# EAGLE design v0.1.0 (EAGLE 9.2.2)

## Sheet 1 of 2: Interface
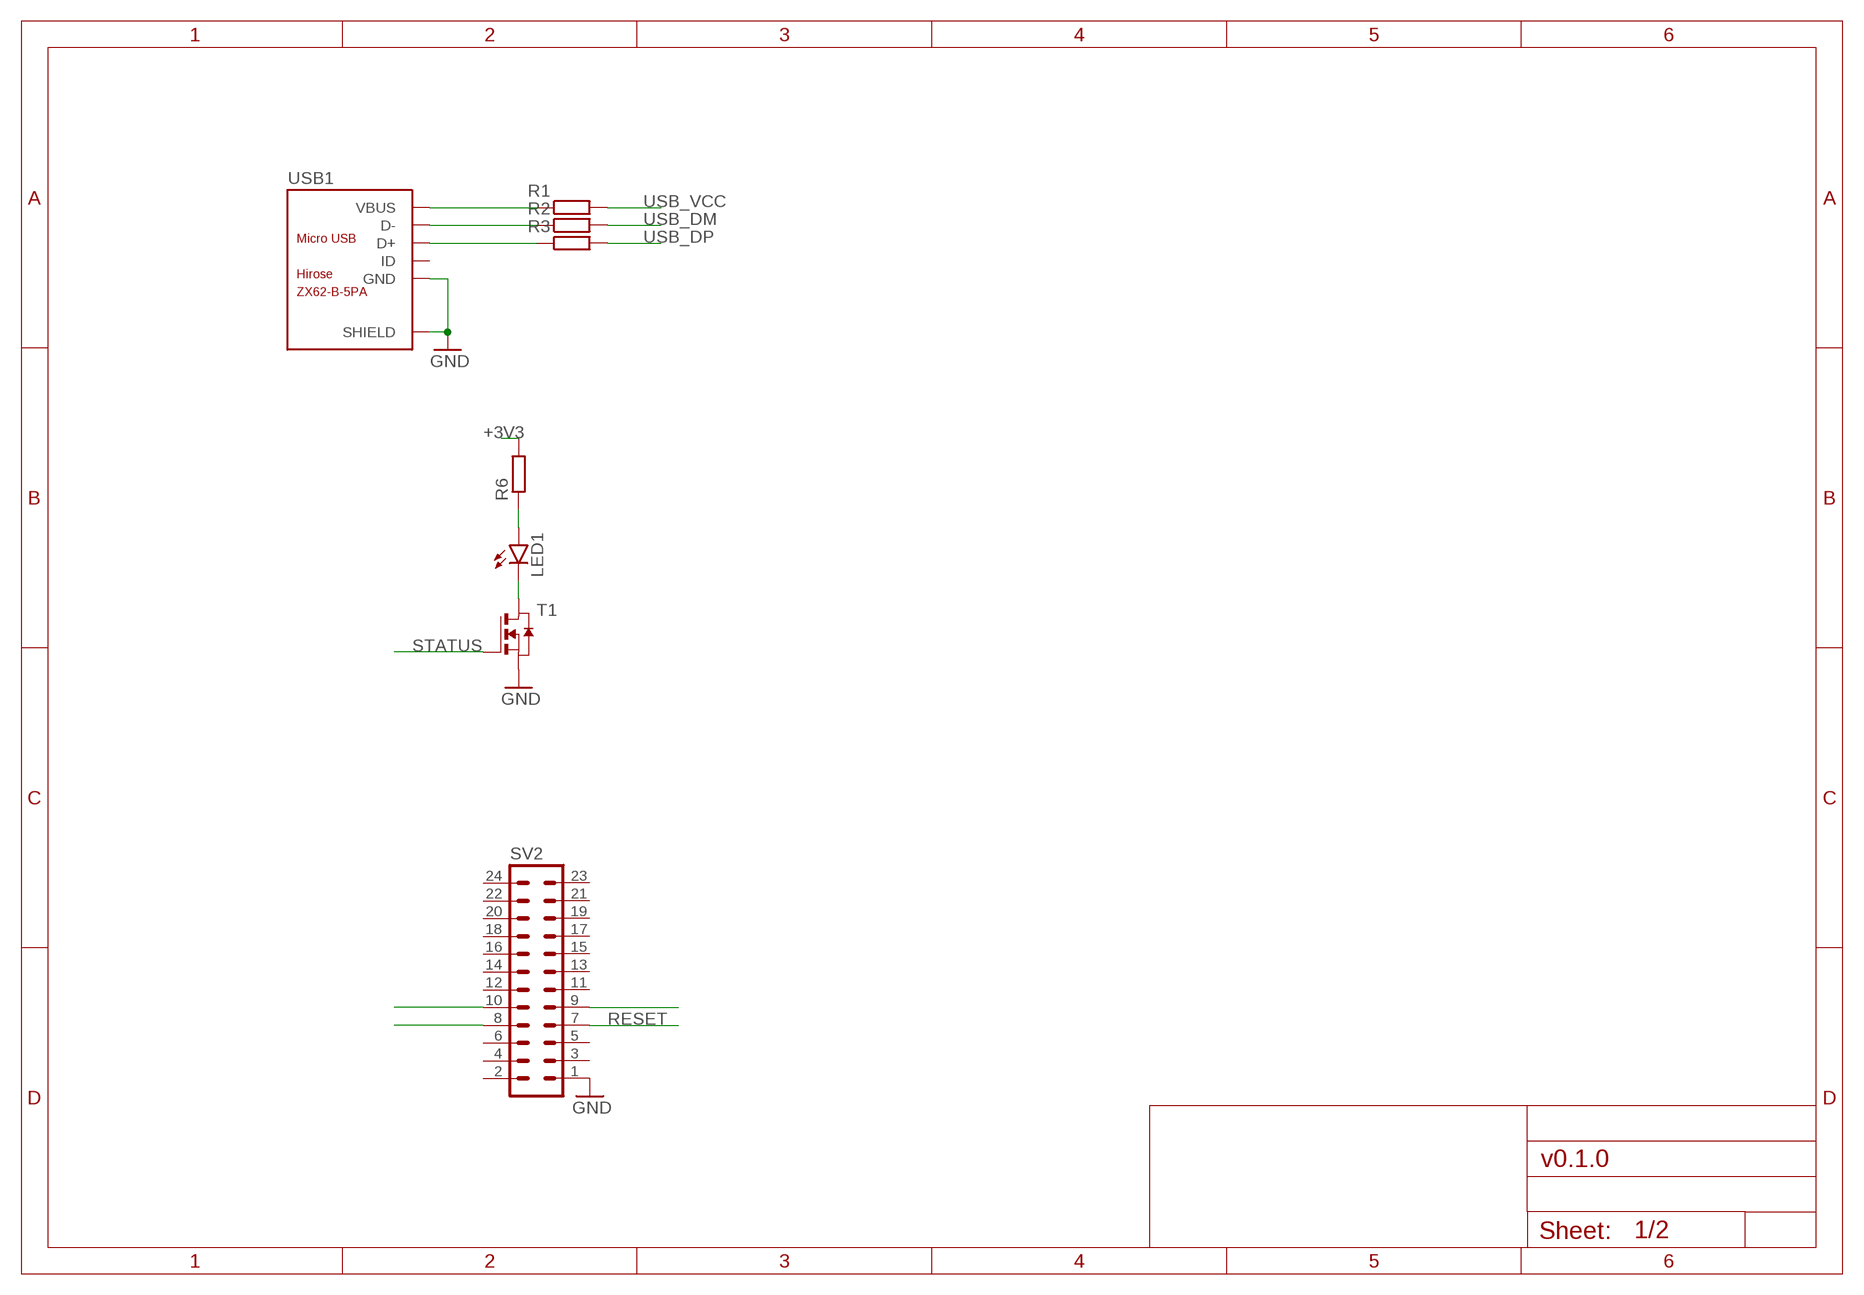
[diagram p0: schematic, sheet 1]

### Parts
LED1  LEDCHIP-LED0603  [CHIP-LED0603]
R1  R-EU_R0402  [R0402]
R2  R-EU_R0402  [R0402]
R3  R-EU_R0402  [R0402]
R6  R-EU_R0402  [R0402]
SV2  MA12-2  [MA12-2]
T1  NMOSSOT23  [SOT-23]
USB1  ZX62-B-5PA  MICRO-USB-SMD(ZX62-B-5PA)  [MICRO-USB5+6P-SMD-0.65-AB]

### Nets
+3V3: R6.2 ; also sheet 2
GND: SV2.1 T1.2(S) USB1.5(GND) USB1.P1(SHIELD) USB1.P2(SHIELD) USB1.P3(SHIELD) USB1.P4(SHIELD) USB1.P5(SHIELD) USB1.P6(SHIELD) ; also sheet 2
N$6: LED1.C T1.1(D)
N$7: SV2.8
N$8: R2.1 USB1.2(D-)
N$9: R3.1 USB1.3(D+)
N$10: SV2.9
N$11: SV2.10
N$12: LED1.A R6.1
RESET: SV2.7 ; also sheet 2
STATUS: T1.3(G) ; also sheet 2
USB_DM: R2.2 ; also sheet 2
USB_DP: R3.2 ; also sheet 2
USB_VCC: R1.2 ; also sheet 2
VBUS: R1.1 USB1.1(VBUS)
Unconnected: SV2.2 SV2.3 SV2.4 SV2.5 SV2.6 SV2.11 SV2.12 SV2.13 SV2.14 SV2.15 SV2.16 SV2.17 SV2.18 SV2.19 SV2.20 SV2.21 SV2.22 SV2.23 SV2.24 USB1.4(ID)

## Sheet 2 of 2: GPS modem
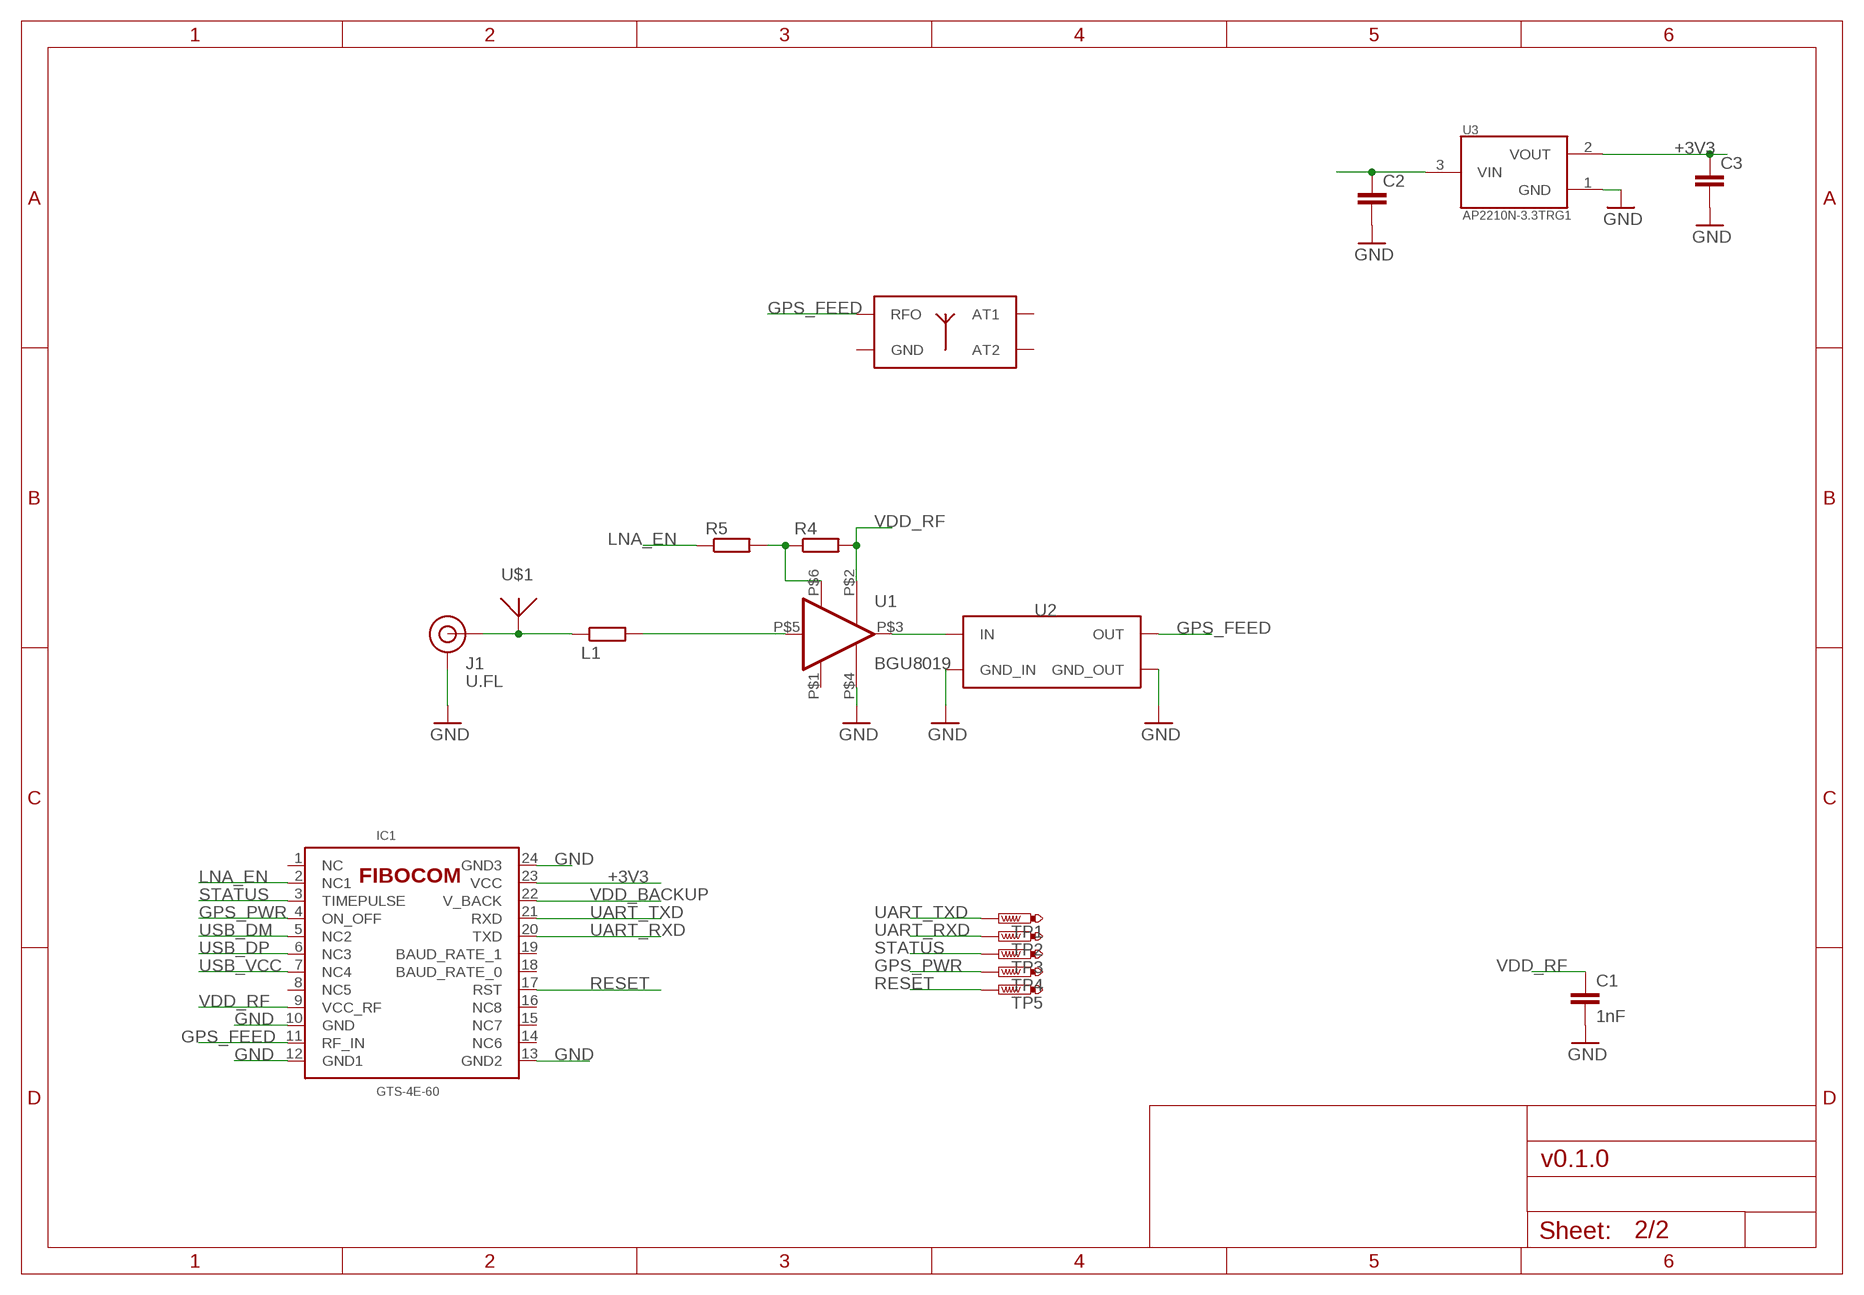
[diagram p1: schematic, sheet 2]

### Parts
ANT1  M20047  [PCBCOMPONENT_1]
C1  1nF  C-EUC0402  [C0402]
C2  C-EUC0805  [C0805]
C3  C-EUC0805  [C0805]
IC1  GTS-4E-60  [_GTS_4E_60]
J1  U.FL  U.FL2PIN  [U.FL]
L1  R-EU_R0402  [R0402]
R4  R-EU_R0402  [R0402]
R5  R-EU_R0402  [R0402]
TP1  PTR1B1,27  [B1,27]
TP2  PTR1B1,27  [B1,27]
TP3  PTR1B1,27  [B1,27]
TP4  PTR1B1,27  [B1,27]
TP5  PTR1B1,27  [B1,27]
U1  BGU8019  [XSON6]
U2  B3916B8813P810  [XSON5]
U3  AP2210N-3.3TRG1  [SOT95P280X145-3N]
U$1  ANT1590-2540A  [2540A]

### Nets
+3V3: C3.1 IC1.23(VCC) U3.2(VOUT) ; also sheet 1
GND: C1.2 C2.2 C3.2 IC1.10(GND) IC1.12(GND1) IC1.13(GND2) IC1.24(GND3) J1.1(GND) J1.2(GND) U1.P$4(GND_RF) U2.2(GND_IN) U2.3(GND_OUT) U2.5(GND_IN) U3.1(GND) ; also sheet 1
GPS_FEED: ANT1.5(RFO) IC1.11(RF_IN) U2.4(OUT)
GPS_PWR: IC1.4(ON_OFF) TP4.TP
LNA_EN: IC1.2(NC1) R5.1
N$1: J1.FEED(SIGNAL) L1.1 U$1.P$1
N$2: U1.P$3(RF_OUT) U2.1(IN)
N$3: R4.1 R5.2 U1.P$6(ENABLE)
N$4: L1.2 U1.P$5(RF_IN)
N$5: C2.1 U3.3(VIN)
RESET: IC1.17(RST) TP5.TP ; also sheet 1
STATUS: IC1.3(TIMEPULSE) TP3.TP ; also sheet 1
UART_RXD: IC1.20(TXD) TP2.TP
UART_TXD: IC1.21(RXD) TP1.TP
USB_DM: IC1.5(NC2) ; also sheet 1
USB_DP: IC1.6(NC3) ; also sheet 1
USB_VCC: IC1.7(NC4) ; also sheet 1
VDD_BACKUP: IC1.22(V_BACK)
VDD_RF: C1.1 IC1.9(VCC_RF) R4.2 U1.P$2(VCC)
Unconnected: ANT1.1(AT1) ANT1.6(AT2) IC1.1(NC) IC1.8(NC5) IC1.14(NC6) IC1.15(NC7) IC1.16(NC8) IC1.18(BAUD_RATE_0) IC1.19(BAUD_RATE_1)

## Power pins joined to a net without a drawn wire
GND: ANT1.2(GND) ANT1.3(GND) ANT1.4(GND) U1.P$1(GND)

## Library data of the parts
ANT1 = antenova:M20047
C1-C3 = rcl:C-EU: CAPACITOR, European symbol; SPICEPREFIX: C
IC1 = fibocom:GTS-4E-60: The GTS-4E is a new generation of GPS receiving module. FIBOCOM GTS 4E 60
J1 = SparkFun-Connectors:U.FL2PIN: SMD Antenna Connector - U.FL 2mm height, 3.0mm x 3.0mm receptacle size. SparkFun Products: SparkFun WiFi Shield - ESP8266 <https://www.sparkfun.com/products/13287> SparkFun ESP8266 Thing <https://www.sparkfun.com/products/13231> SparkFun MiniGen - Pro Mini Signal Generator Shield <https://www.sparkfun.com/products/11420>; PROD_ID: CONN-09193; SF_ID: WRL-09144
L1 R1-R6 = rcl:R-EU_: RESISTOR, European symbol; SPICEPREFIX: R
LED1 = led:LED: LED OSRAM: - CHIPLED LG R971, LG N971, LY N971, LG Q971, LY Q971, LO R971, LY R971 LH N974, LH R974 LS Q976, LO Q976, LY Q976 LO Q996 - Hyper CHIPLED LW Q18S LB Q993, LB Q99A, LB R99A - SideLED LS A670, LO A670, LY A670, LG A670, LP A670 LB A673, LV A673, LT A673, LW A673 LH A674 LY A675 LS A676, LA A676, LO A676, LY A676, LW A676 LS A679, LY A679, LG A679 - Hyper Micro SIDELED® LS Y876, LA Y876, LO Y876, LY Y876 LT Y87S - SmartLED LW L88C, LW L88S LB L89C, LB L89S, LG L890 LS L89K, LO L89K, LY L89K LS L896, LA L896, LO L896, LY L896 - TOPLED LS T670, LO T670, LY T670, LG T670, LP T670 LSG T670, LSP T670, LSY T670, LOP T670, LYG T670 LG T671, LOG T671, LSG T671 LB T673, LV T673, LT T673, LW T673 LH T674 LS T676, LA T676, LO T676, LY T676, LB T676, LH T676, LSB T676, LW T676 LB T67C, LV T67C, LT T67C, LS T67K, LO T67K, LY T67K, LW E67C LS E67B, LA E67B, LO E67B, LY E67B, LB E67C, LV E67C, LT E67C LW T67C LS T679, LY T679, LG T679 LS T770, LO T770, LY T770, LG T770, LP T770 LB T773, LV T773, LT T773, LW T773 LH T774 LS E675, LA E675, LY E675, LS T675 LS T776, LA T776, LO T776, LY T776, LB T776 LHGB T686 LT T68C, LB T68C - Hyper Mini TOPLED® LB M676 - Mini TOPLED Santana® LG M470 LS M47K, LO M47K, LY M47K Source: http://www.osram.convergy.de LUXEON: - LUMILED® LXK2-PW12-R00, LXK2-PW12-S00, LXK2-PW14-U00, LXK2-PW14-V00 LXK2-PM12-R00, LXK2-PM12-S00, LXK2-PM14-U00 LXK2-PE12-Q00, LXK2-PE12-R00, LXK2-PE12-S00, LXK2-PE14-T00, LXK2-PE14-U00 LXK2-PB12-K00, LXK2-PB12-L00, LXK2-PB12-M00, LXK2-PB14-N00, LXK2-PB14-P00, LXK2-PB14-Q00 LXK2-PR12-L00, LXK2-PR12-M00, LXK2-PR14-Q00, LXK2-PR14-R00 LXK2-PD12-Q00, LXK2-PD12-R00, LXK2-PD12-S00 LXK2-PH12-R00, LXK2-PH12-S00 LXK2-PL12-P00, LXK2-PL12-Q00, LXK2-PL12-R00 Source: www.luxeon.com KINGBRIGHT: KA-3528ASYC Source: www.kingbright.com
SV2 = con-lstb:MA12-2: PIN HEADER; OC_FARNELL: unknown; OC_NEWARK: unknown
T1 = zetex:NMOSSOT23: MOS FET; OC_FARNELL: unknown; OC_NEWARK: unknown
TP1-TP5 = testpad:PTR1: TEST PIN
U1 = nxp:BGU8019
U2 = rf360:B3916
U3 = AP2210N-3.3TRG1:AP2210N-3.3TRG1: LDO Regulator Pos 5V 0.3A 3-Pin SOT-23 T/R; AVAILABILITY: Unavailable; DESCRIPTION: LDO Regulator Pos 3.3V 0.3A 3-Pin SOT-23 T/R; MF: Diodes Inc.; MP: AP2210N-3.3TRG1; PACKAGE: SOT-23 Diodes Inc.; PRICE: None
U$1 = sr-passives:ANT1590-
USB1 = Seeed-Connector:MICRO-USB-SMD(ZX62-B-5PA): 320010005; MPN: ZX62-B-5PA

## Board
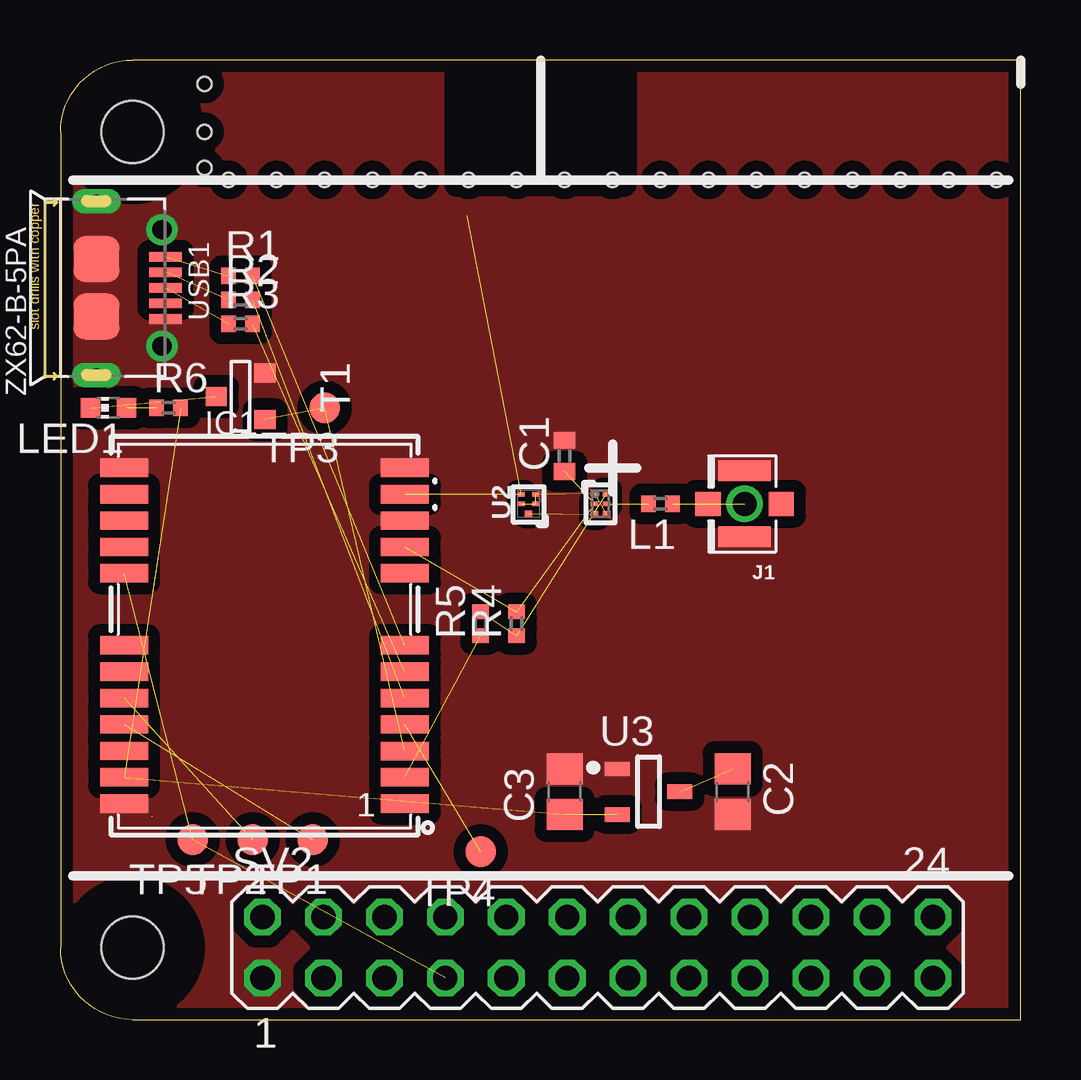
[diagram p2: board, top side]
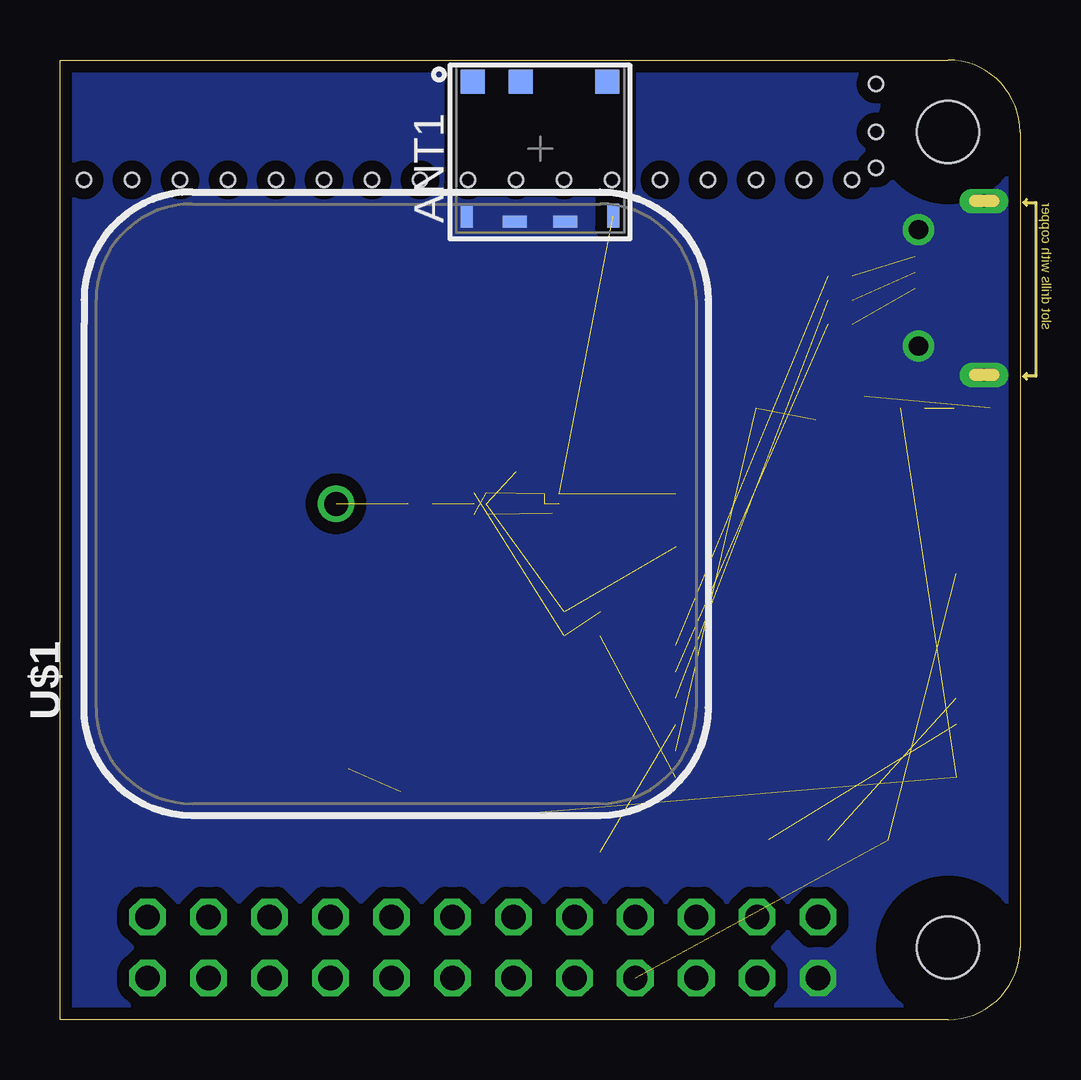
[diagram p3: board, bottom side, seen from below]

Size 40 x 40 mm. Coordinates in mm from the lower left corner, seen from the top.
Outline: 3,0 40,0 40,40 3,40 arc90 0,37 0,3 arc90 3,0
Copper layers (1*16): Top 0.035mm / dielectric 1.5mm / Bottom 0.035mm
Design rules "default *": minimum track width 6mil, minimum drill 0.35mm, track to track 6mil, track to pad 6mil, pad to pad 6mil, via to via 6mil, smd to smd 6mil, copper to edge 0.4mm, drill to drill 6mil, minimum pad ring 10mil, minimum via ring 8mil, stop-mask expansion 4mil, vias tented up to drill 0mil, thermal gap 10mil
Holes 2.6 mm at 3,3 3,37
Holes 0.6 mm at 39,35 37,35 35,35 33,35 31,35 29,35 27,35 25,35 23,35 21,35 19,35 17,35 15,35 13,35 11,35 9,35 7,35 6,39 6,37 6,35.5
tRestrict: area 0.5,0.5 to 5.5,5.5; area 0.5,34.5 to 5.5,39.5
bRestrict: area 0.5,0.5 to 5.5,5.5; area 0.5,34.5 to 5.5,39.5

### Footprints (pad centres in the part's own frame; a part is rotated, then mirrored left to right if it is on the bottom)
PCBCOMPONENT_1 = smd 1 x 1: 1 -2.8,2.8; 6 2.8,2.8; 7 -0.8,2.8 | smd 0.5 x 1: 2 -3.05,-2.794; 5 3.05,-2.794 | smd 1 x 0.5: 3 -1.05,-3.048; 4 1.05,-3.048
C0402 = smd 0.7 x 0.9: 1 -0.65,0; 2 0.65,0
C0805 = smd 1.3 x 1.5: 1 -0.95,0; 2 0.95,0
_GTS_4E_60 = smd 0.76 x 2: 1 -7,-5.85; 2 -5.9,-5.85; 3 -4.81,-5.85; 4 -3.7,-5.85; 5 -2.6,-5.85; 6 -1.5,-5.85; 7 -0.4,-5.85; 8 2.6,-5.85; 9 3.7,-5.85; 10 4.8,-5.85; 11 5.9,-5.85; 12 7,-5.85; 13 7,5.85; 14 5.9,5.85; 15 4.8,5.85; 16 3.7,5.85; 17 2.6,5.85; 18 -0.4,5.85; 19 -1.5,5.85; 20 -2.6,5.85; 21 -3.7,5.85; 22 -4.8,5.85; 23 -5.9,5.85; 24 -7,5.85
U.FL = smd 2.2 x 0.85: 1 0,1.375; 2 0,-1.375 | smd 1.05 x 1: FEED 1.525,0; NC -1.525,0
R0402 = smd 0.6 x 0.7: 1 -0.5,0; 2 0.5,0
CHIP-LED0603 = smd 0.8 x 0.8: A 0,-0.75; C 0,0.75
MA12-2 = drill 1.016 octagon: 1 -13.97,-1.27; 2 -13.97,1.27; 3 -11.43,-1.27; 4 -11.43,1.27; 5 -8.89,-1.27; 6 -8.89,1.27; 7 -6.35,-1.27; 8 -6.35,1.27; 9 -3.81,-1.27; 10 -3.81,1.27; 11 -1.27,-1.27; 12 -1.27,1.27; 13 1.27,-1.27; 14 1.27,1.27; 15 3.81,-1.27; 16 3.81,1.27; 17 6.35,-1.27; 18 6.35,1.27; 19 8.89,-1.27; 20 8.89,1.27; 21 11.43,-1.27; 22 11.43,1.27; 23 13.97,-1.27; 24 13.97,1.27
SOT-23 = smd 0.787 x 0.889: 1 0.025,-1.016; 2 -0.94,1.016; 3 0.991,1.016
B1,27 = smd 1.27 x 1.27: TP 0,0
XSON6 = smd 0.3 x 0.3: P$1 0.25,-0.45; P$3 0.25,0.45; P$4 -0.25,0.45; P$6 -0.25,-0.45 | smd 0.3 x 0.2: P$2 0.25,0; P$5 -0.25,0
XSON5 = smd 0.25 x 0.3: 1 -0.4,0 | smd 0.2 x 0.3: 2 0,-0.3; 3 0.4,-0.3; 4 0.4,0.3; 5 0,0.3
SOT95P280X145-3N = smd 1.05 x 0.6: 1 -1.3,0.95; 2 -1.3,-0.95; 3 1.3,0
2540A = drill 1: P$1 0,2.5
MICRO-USB5+6P-SMD-0.65-AB = smd 0.4 x 1.35: 1 -1.3,2.875; 2 -0.65,2.875; 3 0,2.875; 4 0.65,2.875; 5 1.3,2.875 | smd 1.9 x 1.9: P1 -1.2,0; P2 1.2,0 | drill 0.508 pad 1.016 long: P3 -3.625,0; P4 3.625,0 | drill 0.8: P5 -2.425,2.73; P6 2.425,2.73

### Placement (x,y rotation side)
ANT1  20,36.3 0 bottom
C1  21,23.5 90 top
C2  28,9.5 270 top
C3  21,9.5 90 top
IC1  8.5,16 90 top
J1  28.5,21.5 180 top
L1  25,21.5 180 top
LED1  2,25.5 90 top
R1  7.5,31 0 top
R2  7.5,30 0 top
R3  7.5,29 0 top
R4  19,16.5 90 top
R5  17.5,16.5 90 top
R6  4.5,25.5 0 top
SV2  22.38,3 0 top
T1  7.5,26 270 top
TP1  10.5,7.5 180 top
TP2  8,7.5 180 top
TP3  11,25.5 180 top
TP4  17.5,7 180 top
TP5  5.5,7.5 180 top
U1  22.5,21.5 180 top
U2  19.5,21.5 90 top
U3  24.5,9.5 0 top
U$1  26,21.5 90 bottom
USB1  1.5,30.5 270 top

### Tracks (layer width: path | path; a pad name or v marks a point on that pad's centre or on a via)
+3V3  (3 unrouted)
GND  (4 unrouted)
  pour Top (isolate 0.5, no thermals): -1,41 41,41 41,-1 -1,-1
  pour Bottom (isolate 0.5, no thermals): -2,42 42,42 42,-2 -2,-2
GPS_FEED  (2 unrouted)
GPS_PWR  (1 unrouted)
LNA_EN  (1 unrouted)
N$1  (2 unrouted)
N$2  (1 unrouted)
N$3  (2 unrouted)
N$4  (1 unrouted)
N$5  (1 unrouted)
N$6  (1 unrouted)
N$8  (1 unrouted)
N$9  (1 unrouted)
N$12  (1 unrouted)
RESET  (2 unrouted)
STATUS  (2 unrouted)
UART_RXD  (1 unrouted)
UART_TXD  (1 unrouted)
USB_DM  (1 unrouted)
USB_DP  (1 unrouted)
USB_VCC  (1 unrouted)
VBUS  (1 unrouted)
VDD_RF  (3 unrouted)